# Altium schematic sheet Sheet1.SchDoc
size A2
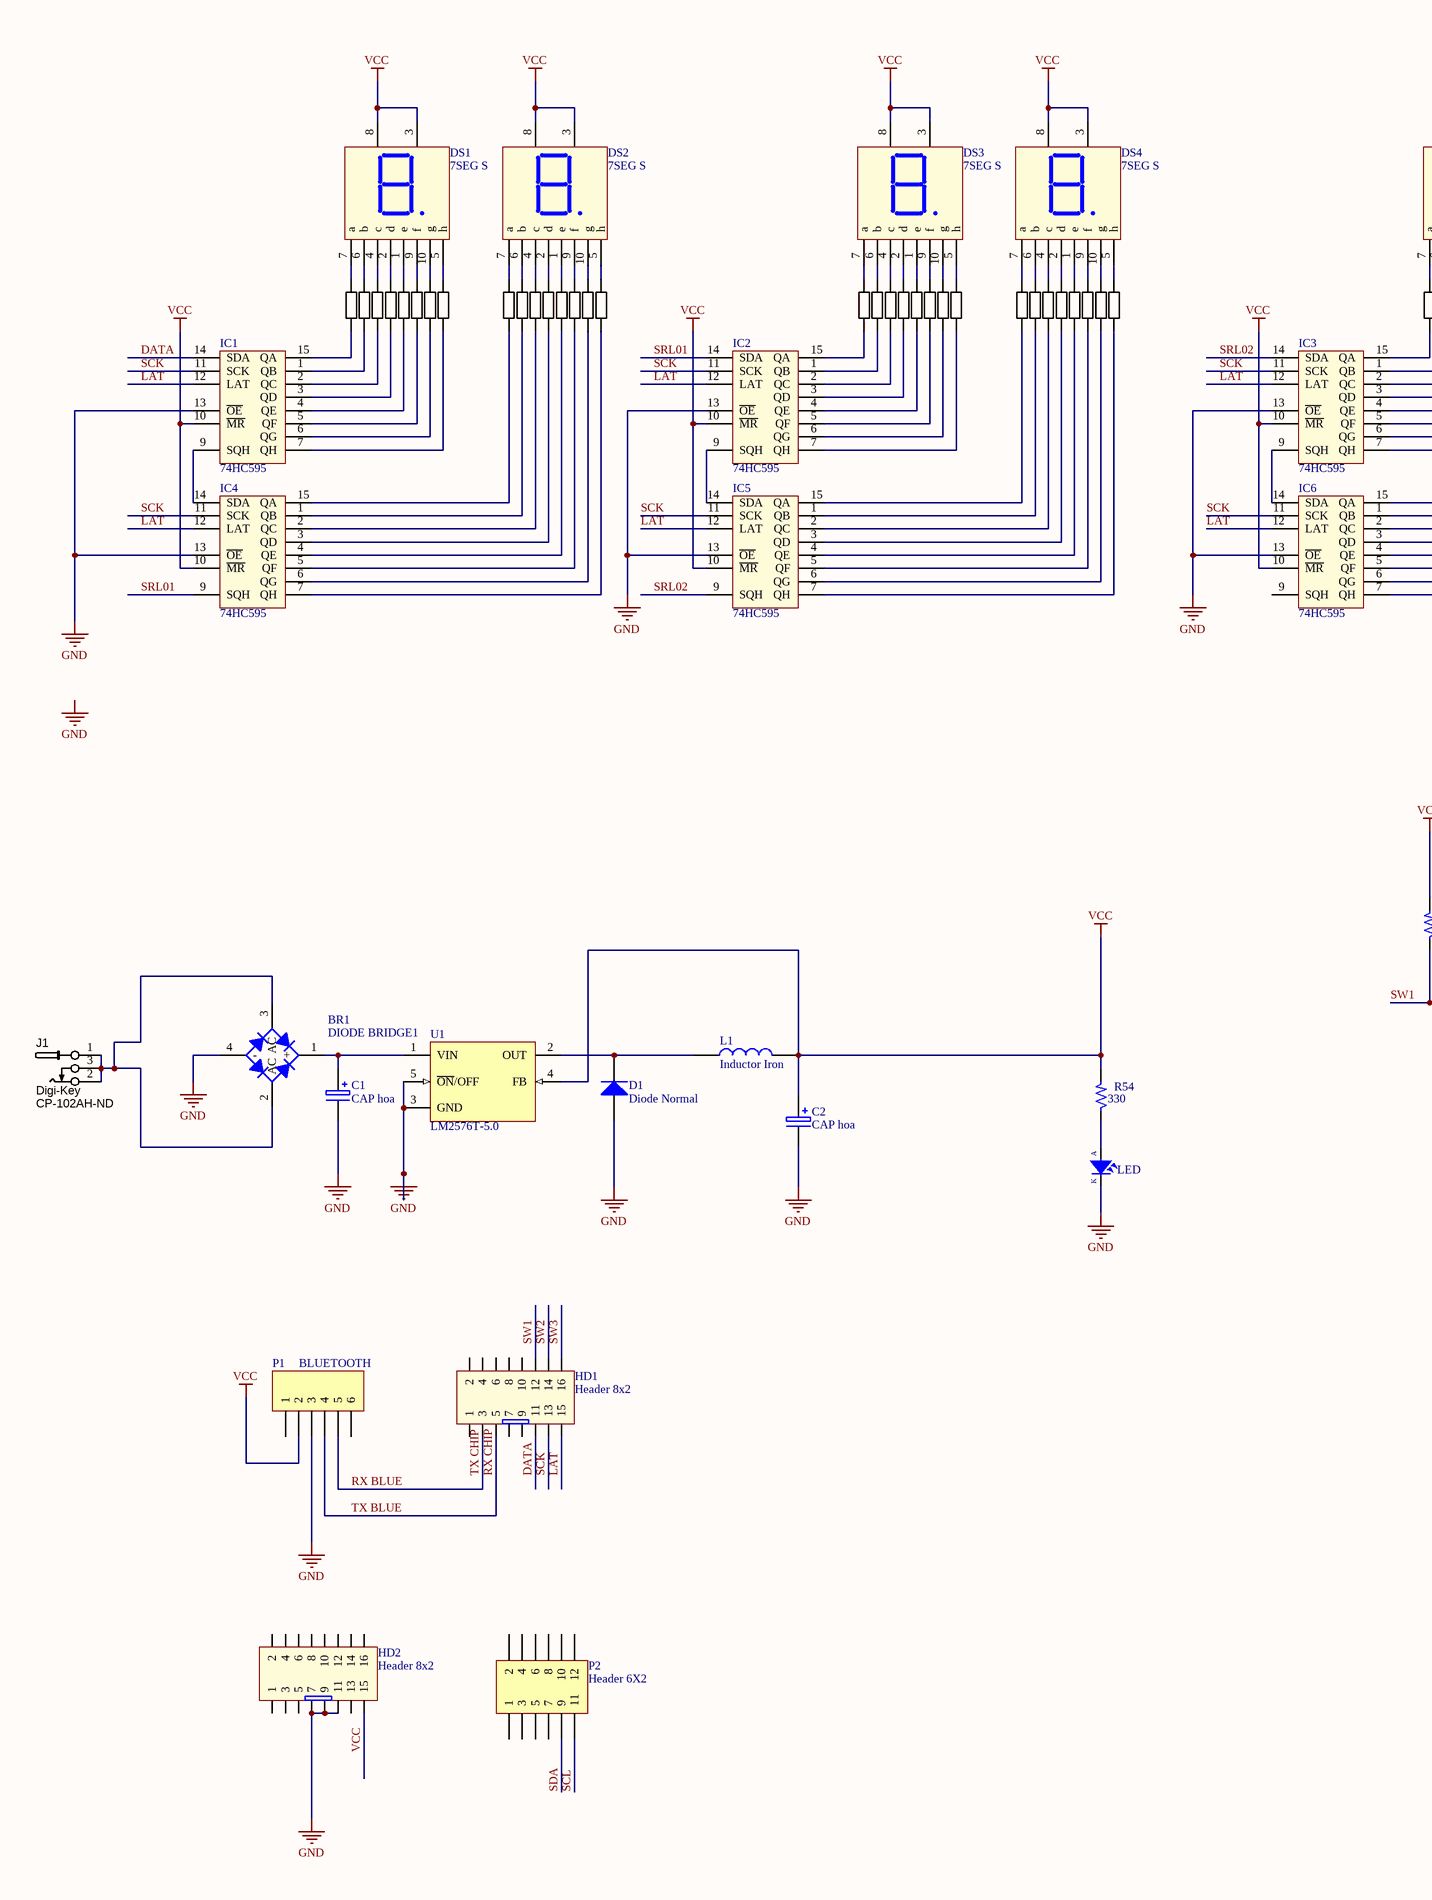
[diagram p0: Sheet1.SchDoc, left]
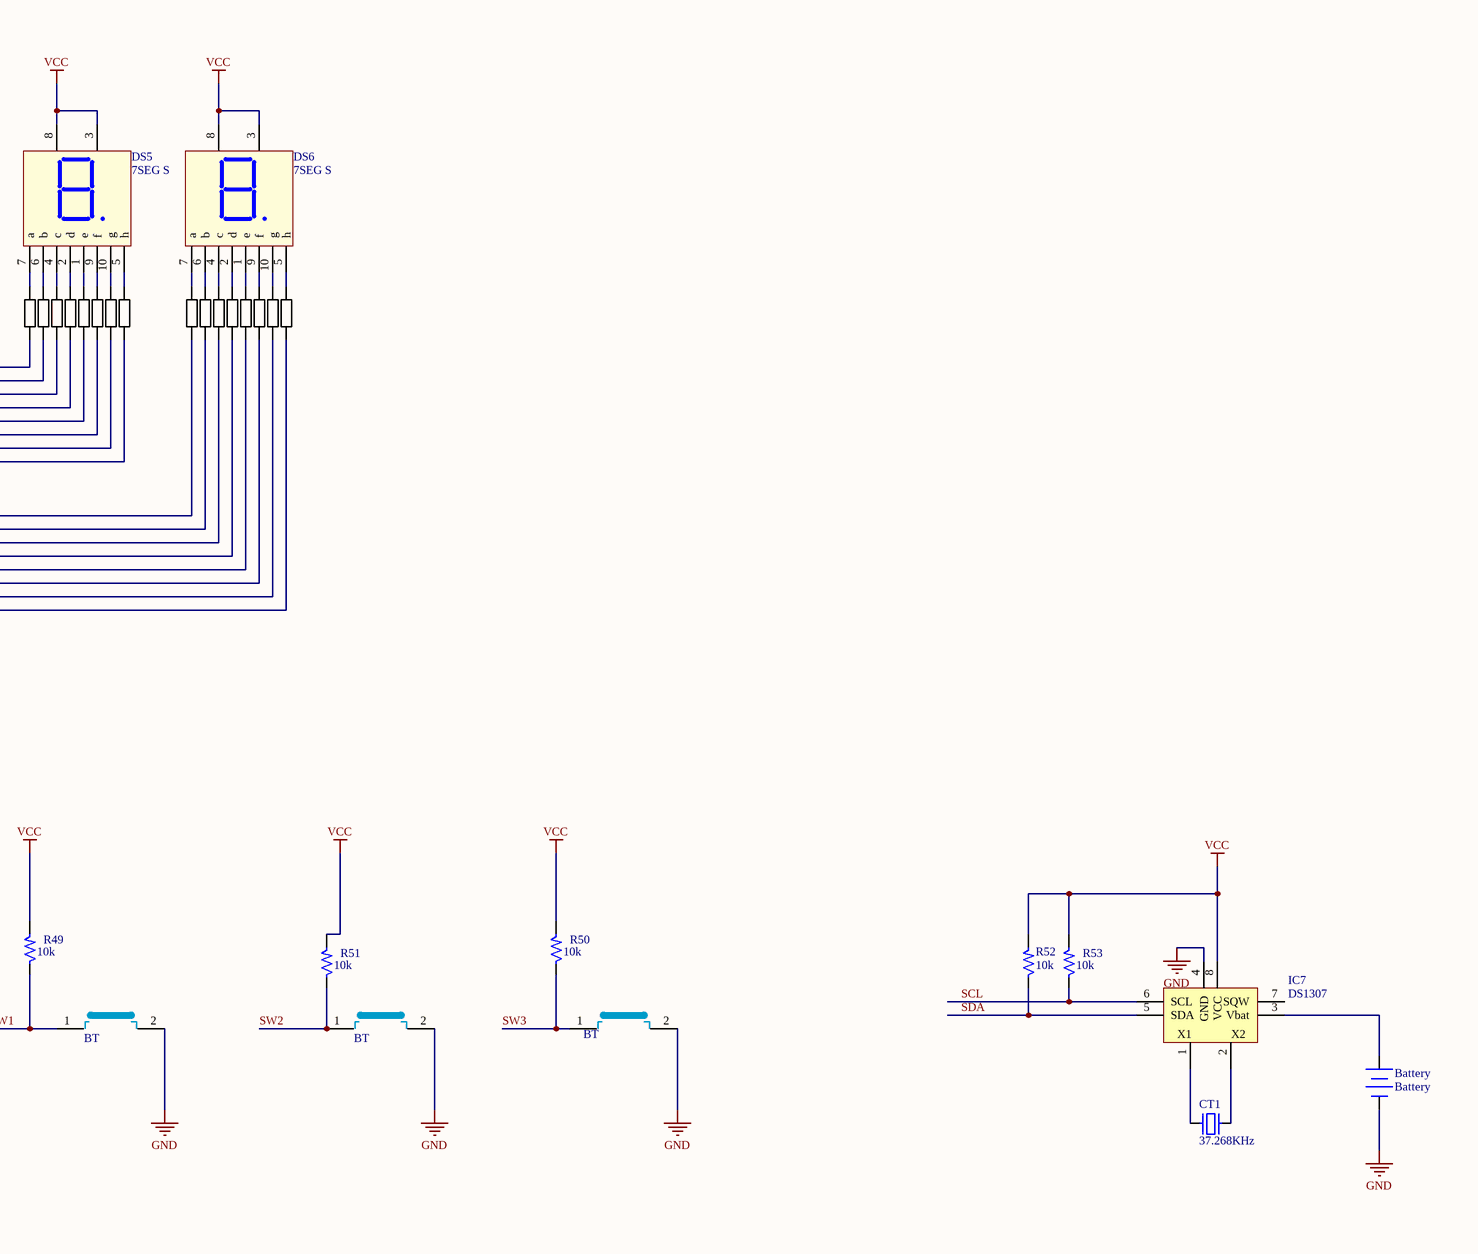
[diagram p1: Sheet1.SchDoc, right]

## Parts
Battery  Battery  [PIN3V]
BR1  DIODE BRIDGE1  [CAU 1A]
BT1  BT  [SW4]
BT2  BT  [SW4]
BT3  BT  [SW4]
C1  CAP hoa  [CP1.5/3.4]
C2  CAP hoa  [CP1.5/3.4]
CT1  37.268KHz  [CRYSTAL 32,768 kHz]
D1  Diode Normal  [DIODE/NOM/0.5A]
DS1  7SEG S  [7SEGS]
DS2  7SEG S  [7SEGS]
DS3  7SEG S  [7SEGS]
DS4  7SEG S  [7SEGS]
DS5  7SEG S  [7SEGS]
DS6  7SEG S  [7SEGS]
HD1  Header 8x2  [HED8x2]
HD2  Header 8x2  [HED8x2]
IC1  74HC595  [DIP16/W0.3]
IC2  74HC595  [DIP16/W0.3]
IC3  74HC595  [DIP16/W0.3]
IC4  74HC595  [DIP16/W0.3]
IC5  74HC595  [DIP16/W0.3]
IC6  74HC595  [DIP16/W0.3]
IC7  DS1307  [DIP8]
J1  Supplier 1: Digi-Key  Supplier Part Number 1: CP-102AH-ND  [CONN_PWR_JACK_2.1x5.5mm]  (hidden comment: CONN_PWR_JACK_2.1x5.5mm)
L1  Inductor Iron  [PE-92102-100uH]
LED1  LED  [LED-3]
P1  BLUETOOTH  [HDR1X6]
P2  Header 6X2  [HDR2X6]
R1  Carbon Film  [RESC1005X40N]  (value not drawn)
R2  Carbon Film  [RESC1005X40N]  (value not drawn)
R3  Carbon Film  [RESC1005X40N]  (value not drawn)
R4  Carbon Film  [RESC1005X40N]  (value not drawn)
R5  Carbon Film  [RESC1005X40N]  (value not drawn)
R6  Carbon Film  [RESC1005X40N]  (value not drawn)
R7  Carbon Film  [RESC1005X40N]  (value not drawn)
R8  Carbon Film  [RESC1005X40N]  (value not drawn)
R9  Carbon Film  [RESC1005X40N]  (value not drawn)
R10  Carbon Film  [RESC1005X40N]  (value not drawn)
R11  Carbon Film  [RESC1005X40N]  (value not drawn)
R12  Carbon Film  [RESC1005X40N]  (value not drawn)
R13  Carbon Film  [RESC1005X40N]  (value not drawn)
R14  Carbon Film  [RESC1005X40N]  (value not drawn)
R15  Carbon Film  [RESC1005X40N]  (value not drawn)
R16  Carbon Film  [RESC1005X40N]  (value not drawn)
R17  Carbon Film  [RESC1005X40N]  (value not drawn)
R18  Carbon Film  [RESC1005X40N]  (value not drawn)
R19  Carbon Film  [RESC1005X40N]  (value not drawn)
R20  Carbon Film  [RESC1005X40N]  (value not drawn)
R21  Carbon Film  [RESC1005X40N]  (value not drawn)
R22  Carbon Film  [RESC1005X40N]  (value not drawn)
R23  Carbon Film  [RESC1005X40N]  (value not drawn)
R24  Carbon Film  [RESC1005X40N]  (value not drawn)
R25  Carbon Film  [RESC1005X40N]  (value not drawn)
R26  Carbon Film  [RESC1005X40N]  (value not drawn)
R27  Carbon Film  [RESC1005X40N]  (value not drawn)
R28  Carbon Film  [RESC1005X40N]  (value not drawn)
R29  Carbon Film  [RESC1005X40N]  (value not drawn)
R30  Carbon Film  [RESC1005X40N]  (value not drawn)
R31  Carbon Film  [RESC1005X40N]  (value not drawn)
R32  Carbon Film  [RESC1005X40N]  (value not drawn)
R33  Carbon Film  [RESC1005X40N]  (value not drawn)
R34  Carbon Film  [RESC1005X40N]  (value not drawn)
R35  Carbon Film  [RESC1005X40N]  (value not drawn)
R36  Carbon Film  [RESC1005X40N]  (value not drawn)
R37  Carbon Film  [RESC1005X40N]  (value not drawn)
R38  Carbon Film  [RESC1005X40N]  (value not drawn)
R39  Carbon Film  [RESC1005X40N]  (value not drawn)
R40  Carbon Film  [RESC1005X40N]  (value not drawn)
R41  Carbon Film  [RESC1005X40N]  (value not drawn)
R42  Carbon Film  [RESC1005X40N]  (value not drawn)
R43  Carbon Film  [RESC1005X40N]  (value not drawn)
R44  Carbon Film  [RESC1005X40N]  (value not drawn)
R45  Carbon Film  [RESC1005X40N]  (value not drawn)
R46  Carbon Film  [RESC1005X40N]  (value not drawn)
R47  Carbon Film  [RESC1005X40N]  (value not drawn)
R48  Carbon Film  [RESC1005X40N]  (value not drawn)
R49  10k  [R1/4W]
R50  10k  [R1/4W]
R51  10k  [R1/4W]
R52  10k  [R1/4W]
R53  10k  [R1/4W]
R54  330  [R1/4W]
U1  LM2576T-5.0  [LM2576t]

## Nets
GND: Battery.2(-) BR1.4(-) BT1.2 BT2.2 BT3.2 C1.2 C2.2 D1.1(A) HD2.7 HD2.9 HD2.11 IC1.8(GND) IC1.13(~{OE}) IC2.8(GND) IC2.13(~{OE}) IC3.8(GND) IC3.13(~{OE}) IC4.8(GND) IC4.13(~{OE}) IC5.8(GND) IC5.13(~{OE}) IC6.8(GND) IC6.13(~{OE}) IC7.4(GND) LED1.2(K) P1.3 U1.3(GND) U1.5(~{ON}/OFF)
VCC: C2.1 DS1.3(Vcc) DS1.8(Vcc) DS2.3(Vcc) DS2.8(Vcc) DS3.3(Vcc) DS3.8(Vcc) DS4.3(Vcc) DS4.8(Vcc) DS5.3(Vcc) DS5.8(Vcc) DS6.3(Vcc) DS6.8(Vcc) HD2.15 IC1.10(~{MR}) IC1.16(VCC) IC2.10(~{MR}) IC2.16(VCC) IC3.10(~{MR}) IC3.16(VCC) IC4.10(~{MR}) IC4.16(VCC) IC5.10(~{MR}) IC5.16(VCC) IC6.10(~{MR}) IC6.16(VCC) IC7.8(VCC) L1.2 P1.2 R49.2 R50.2 R51.2 R52.2 R53.2 R54.2 U1.4(FB)
DATA: HD1.11 IC1.14(SDA)
LAT: HD1.15 IC1.12(LAT) IC2.12(LAT) IC3.12(LAT) IC4.12(LAT) IC5.12(LAT) IC6.12(LAT)
RX BLUE: HD1.3 P1.5  [also labelled TX CHIP]
RX CHIP: HD1.5 P1.4  [also labelled TX BLUE]
SCK: HD1.13 IC1.11(SCK) IC2.11(SCK) IC3.11(SCK) IC4.11(SCK) IC5.11(SCK) IC6.11(SCK)
SCL: IC7.6(SCL) P2.11 R53.1
SDA: IC7.5(SDA) P2.9 R52.1
SRL01: IC2.14(SDA) IC4.9(SQH)
SRL02: IC3.14(SDA) IC5.9(SQH)
SW1: BT1.1 HD1.12 R49.1
SW2: BT2.1 HD1.14 R51.1
SW3: BT3.1 HD1.16 R50.1
NetBattery_1: Battery.1(+) IC7.3(Vbat)
NetBR1_1: BR1.1(+) C1.1 U1.1(VIN)
NetBR1_2: BR1.2(AC) BR1.3(AC) J1.1 J1.2 J1.3
NetCT1_1: CT1.1 IC7.1(X1)
NetCT1_2: CT1.2 IC7.2(X2)
NetD1_2: D1.2(K) L1.1 U1.2(OUT)
NetDS1_1: DS1.1(e) R5.1
NetDS1_2: DS1.2(d) R4.1
NetDS1_4: DS1.4(c) R3.1
NetDS1_5: DS1.5(h) R8.1
NetDS1_6: DS1.6(b) R2.1
NetDS1_7: DS1.7(a) R1.1
NetDS1_9: DS1.9(f) R6.1
NetDS1_10: DS1.10(g) R7.1
NetDS2_1: DS2.1(e) R13.1
NetDS2_2: DS2.2(d) R12.1
NetDS2_4: DS2.4(c) R11.1
NetDS2_5: DS2.5(h) R16.1
NetDS2_6: DS2.6(b) R10.1
NetDS2_7: DS2.7(a) R9.1
NetDS2_9: DS2.9(f) R14.1
NetDS2_10: DS2.10(g) R15.1
NetDS3_1: DS3.1(e) R21.1
NetDS3_2: DS3.2(d) R20.1
NetDS3_4: DS3.4(c) R19.1
NetDS3_5: DS3.5(h) R24.1
NetDS3_6: DS3.6(b) R18.1
NetDS3_7: DS3.7(a) R17.1
NetDS3_9: DS3.9(f) R22.1
NetDS3_10: DS3.10(g) R23.1
NetDS4_1: DS4.1(e) R29.1
NetDS4_2: DS4.2(d) R28.1
NetDS4_4: DS4.4(c) R27.1
NetDS4_5: DS4.5(h) R32.1
NetDS4_6: DS4.6(b) R26.1
NetDS4_7: DS4.7(a) R25.1
NetDS4_9: DS4.9(f) R30.1
NetDS4_10: DS4.10(g) R31.1
NetDS5_1: DS5.1(e) R37.1
NetDS5_2: DS5.2(d) R36.1
NetDS5_4: DS5.4(c) R35.1
NetDS5_5: DS5.5(h) R40.1
NetDS5_6: DS5.6(b) R34.1
NetDS5_7: DS5.7(a) R33.1
NetDS5_9: DS5.9(f) R38.1
NetDS5_10: DS5.10(g) R39.1
NetDS6_1: DS6.1(e) R45.1
NetDS6_2: DS6.2(d) R44.1
NetDS6_4: DS6.4(c) R43.1
NetDS6_5: DS6.5(h) R48.1
NetDS6_6: DS6.6(b) R42.1
NetDS6_7: DS6.7(a) R41.1
NetDS6_9: DS6.9(f) R46.1
NetDS6_10: DS6.10(g) R47.1
NetIC1_1: IC1.1(QB) R2.2
NetIC1_2: IC1.2(QC) R3.2
NetIC1_3: IC1.3(QD) R4.2
NetIC1_4: IC1.4(QE) R5.2
NetIC1_5: IC1.5(QF) R6.2
NetIC1_6: IC1.6(QG) R7.2
NetIC1_7: IC1.7(QH) R8.2
NetIC1_9: IC1.9(SQH) IC4.14(SDA)
NetIC1_15: IC1.15(QA) R1.2
NetIC2_1: IC2.1(QB) R18.2
NetIC2_2: IC2.2(QC) R19.2
NetIC2_3: IC2.3(QD) R20.2
NetIC2_4: IC2.4(QE) R21.2
NetIC2_5: IC2.5(QF) R22.2
NetIC2_6: IC2.6(QG) R23.2
NetIC2_7: IC2.7(QH) R24.2
NetIC2_9: IC2.9(SQH) IC5.14(SDA)
NetIC2_15: IC2.15(QA) R17.2
NetIC3_1: IC3.1(QB) R34.2
NetIC3_2: IC3.2(QC) R35.2
NetIC3_3: IC3.3(QD) R36.2
NetIC3_4: IC3.4(QE) R37.2
NetIC3_5: IC3.5(QF) R38.2
NetIC3_6: IC3.6(QG) R39.2
NetIC3_7: IC3.7(QH) R40.2
NetIC3_9: IC3.9(SQH) IC6.14(SDA)
NetIC3_15: IC3.15(QA) R33.2
NetIC4_1: IC4.1(QB) R10.2
NetIC4_2: IC4.2(QC) R11.2
NetIC4_3: IC4.3(QD) R12.2
NetIC4_4: IC4.4(QE) R13.2
NetIC4_5: IC4.5(QF) R14.2
NetIC4_6: IC4.6(QG) R15.2
NetIC4_7: IC4.7(QH) R16.2
NetIC4_15: IC4.15(QA) R9.2
NetIC5_1: IC5.1(QB) R26.2
NetIC5_2: IC5.2(QC) R27.2
NetIC5_3: IC5.3(QD) R28.2
NetIC5_4: IC5.4(QE) R29.2
NetIC5_5: IC5.5(QF) R30.2
NetIC5_6: IC5.6(QG) R31.2
NetIC5_7: IC5.7(QH) R32.2
NetIC5_15: IC5.15(QA) R25.2
NetIC6_1: IC6.1(QB) R42.2
NetIC6_2: IC6.2(QC) R43.2
NetIC6_3: IC6.3(QD) R44.2
NetIC6_4: IC6.4(QE) R45.2
NetIC6_5: IC6.5(QF) R46.2
NetIC6_6: IC6.6(QG) R47.2
NetIC6_7: IC6.7(QH) R48.2
NetIC6_15: IC6.15(QA) R41.2
NetLED1_1: LED1.1(A) R54.1

Not connected (* = marked no-connect by the designer): HD1 1 2 4 6 7 8 9 10; HD2 1 2 3 4 5 6 8 10 12 13 14 16; IC6 9(SQH); IC7 7(SQW); P1 1 6; P2 1 2 3 4 5 6 7 8 10 12

## Notes on the sheet
- Labels drawn without touching a wire or pin: GND

## Library data of the parts
Battery = Battery: Multicell Battery; Published: 24-Mar-1999; LatestRevisionDate: 17-Jul-2002; LatestRevisionNote: Re-released for DXP Platform.; PackageReference: BAT-2; Publisher: Altium Limited
BT1-BT3 = BUTTON
C1 C2 = CAP hoa: Cap
CT1 = CRYSTAL: Crystal For all Crystal 2pin.; Value: 4Mhz
DS1-DS6 = LED 7S: Single 7 Seg Dipslay; Value: LED 7S SEG
HD1 HD2 = Header 8x2_S: Value: Header 5x2
IC1-IC6 = 74595: 8 Bit Serial input - Parallel Output; Value: 74HC595
J1 = CONN_PWR_JACK_2.1x5.5mm: Power Connector, THT, 2.1mm ID, 5.5mm OD; Manufacturer 1: CUI Inc; Manufacturer Part Number 1: PJ-102AH; SCDType: undef; Category: Connectors; Mounting Type: Through Hole; Package / Case: PCB mount; Value: 2.1mm ID, 5.5mm OD
L1 = Inductor Iron: Inductor
LED1 = LED: LED Single colour Green and Red; Value: LED 3 ly Single Colour
P1 = Header 6: Header, 6-Pin; LatestRevisionDate: 17-Jul-2002; LatestRevisionNote: Re-released for DXP Platform.; Publisher: Altium Limited
P2 = Header 6X2: Header, 6-Pin, Dual row; LatestRevisionDate: 17-Jul-2002; LatestRevisionNote: Re-released for DXP Platform.; Publisher: Altium Limited
R1-R48 = RES_Axial_0.25W: Resistor THD Axial 220 Ohm 0.25W 5% Carbon Film; Manufacturer 1: Yageo; Manufacturer Part Number 1: CFR-25JB-220R; Ratings: 1/4W; SCDType: spec; Value: 220R; Tolerance: ±5%; Package / Case: Axial; Supplier 1: Digi-Key; Supplier Part Number 1: 220QBK-ND
R49-R54 = Res
U1 = LM2576T-5.0: SIMPLE SWITCHER; 3A Step-Down Voltage Regulator; Manufacturer: National Semiconductor; PackageTopMarking: NSUZXYTT*LM2576T*-5.0 P+; PowerWise: N; FirstPublished: 4-Dec-2008; DatasheetVersion: Aug-2004; PackageVersion: revJ, Jan-1992; PackageReference: T05A; Publisher: Altium Limited; PackageDescription: TO-220, Molded, 5 Lead, Straight; CompType: Switcher; PartNumber: LM2576T-5.0; RoHS: O; PinCount: 5; DigiKeyPartNumber: LM2576T-5.0-ND; Code_JEDEC: TO-220-AB; ComponentLink1Description: LM2576 Datasheet; ComponentLink1URL: http://www.national.com/ds/LM/LM2576.pdf; ComponentLink2Description: LM2576 Web Page; ComponentLink2URL: http://www.national.com/pf/LM/LM2576.html; ComponentLink3Description: T05A Package Page; ComponentLink3URL: http://www.national.com/packaging/folders/t05a.html
D1 = Diode Normal: Published: 8-Jun-2000; LatestRevisionDate: 17-Jul-2002; LatestRevisionNote: Re-released for DXP Platform.; DatasheetDocument: 1997; PackageReference: DO-35; Publisher: Altium Limited; Code_JEDEC: DO-204-AH; ComponentLink1Description: Manufacturer Link; ComponentLink1URL: http://www.fairchildsemi.com/; ComponentLink2Description: Datasheet; ComponentLink2URL: http://www.fairchildsemi.com/ds/1N%2F1N4448.pdf